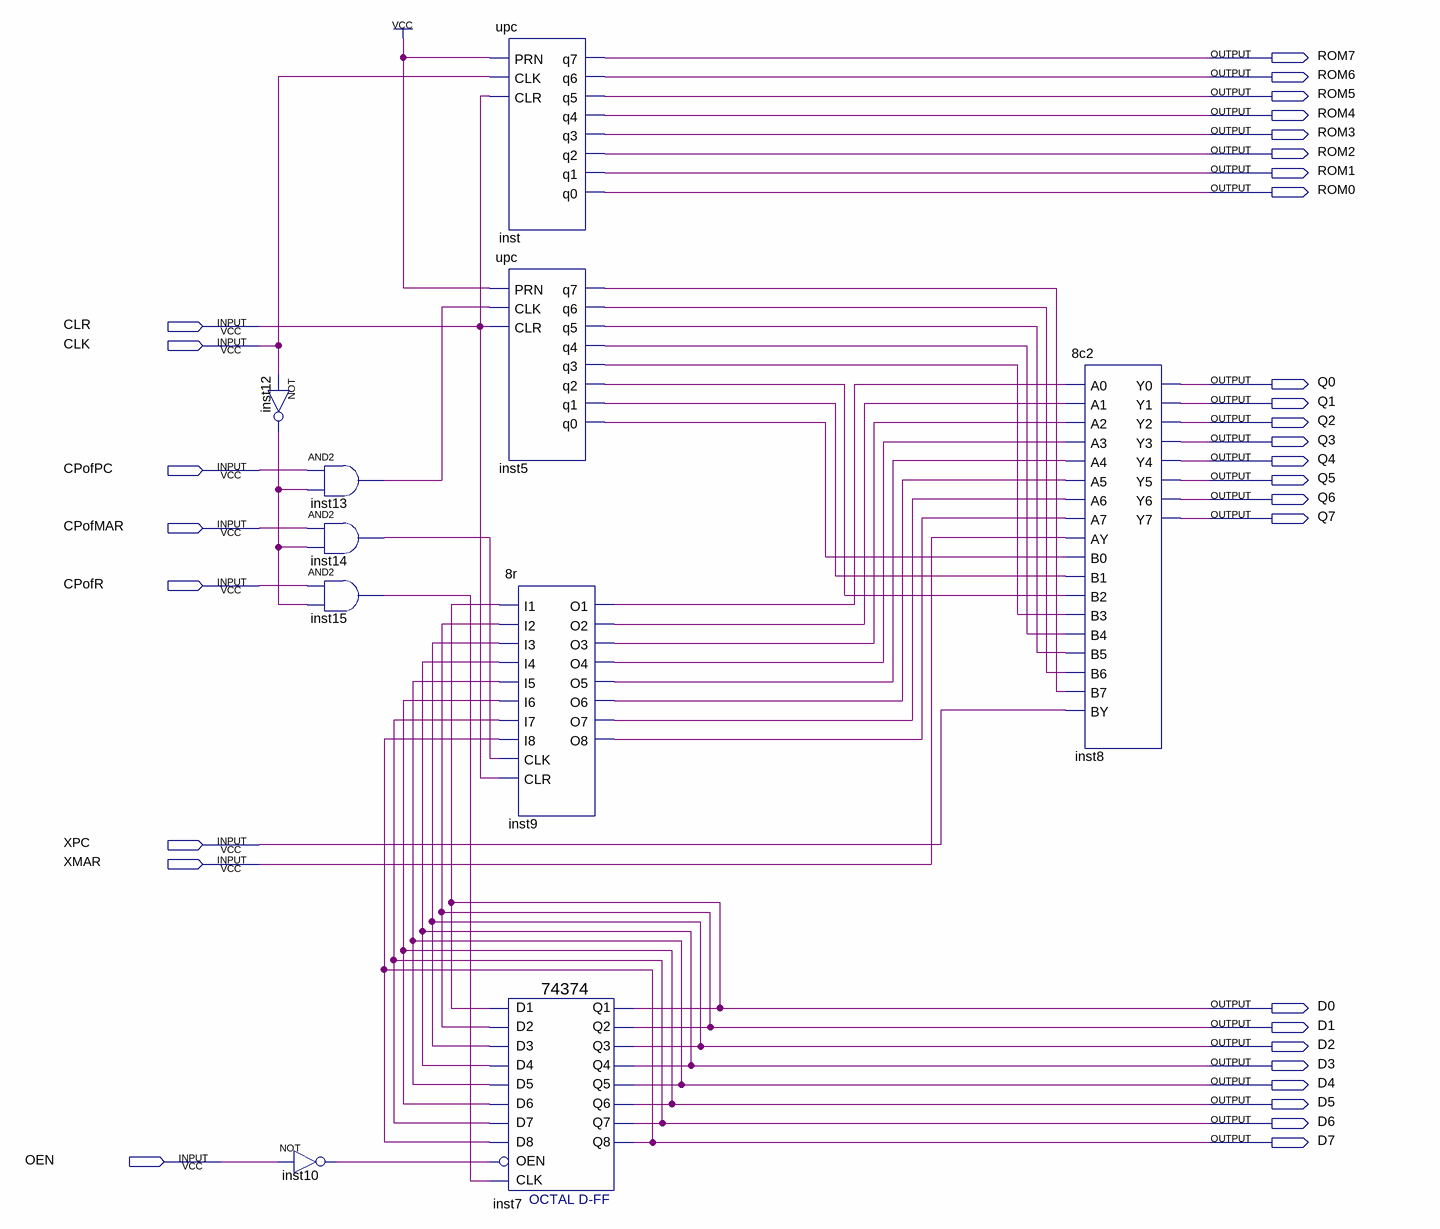
[diagram p0: schematic sheet]
// Quartus schematic final4.bdf as structural Verilog: 10 symbols, 32 pins
module final4 (
  input  CLR,
  input  CLK,
  input  CPofPC,
  input  CPofMAR,
  input  CPofR,
  input  XPC,
  input  XMAR,
  input  OEN,
  output ROM7,
  output ROM6,
  output ROM5,
  output ROM4,
  output ROM3,
  output ROM2,
  output ROM1,
  output ROM0,
  output Q0,
  output Q1,
  output Q2,
  output Q3,
  output Q4,
  output Q5,
  output Q6,
  output Q7,
  output D0,
  output D1,
  output D2,
  output D3,
  output D4,
  output D5,
  output D6,
  output D7
);

  wire inst5_q0, inst5_q1, inst5_q2, inst5_q3, inst5_q4, inst5_q5, inst5_q6, inst5_q7, inst9_o1, inst9_o2,
       inst9_o3, inst9_o4, inst9_o5, inst9_o6, inst9_o7, inst9_o8, inst10_out, inst12_out, inst13_out,
       inst14_out, inst15_out;

  not inst12 (inst12_out, CLK);
  not inst10 (inst10_out, OEN);
  and inst13 (inst13_out, CPofPC, inst12_out);
  and inst14 (inst14_out, CPofMAR, inst12_out);
  and inst15 (inst15_out, CPofR, inst12_out);
  upc inst (
    .PRN(1'b1), .CLK(CLK), .CLR(CLR), .q7(ROM7), .q6(ROM6), .q5(ROM5), .q4(ROM4), .q3(ROM3), .q2(ROM2),
    .q1(ROM1), .q0(ROM0));
  upc inst5 (
    .PRN(1'b1), .CLK(inst13_out), .CLR(CLR), .q7(inst5_q7), .q6(inst5_q6), .q5(inst5_q5), .q4(inst5_q4),
    .q3(inst5_q3), .q2(inst5_q2), .q1(inst5_q1), .q0(inst5_q0));
  \8r  inst9 (
    .I1(D0), .I2(D1), .I3(D2), .I4(D3), .I5(D4), .I6(D5), .I7(D6), .I8(D7), .CLK(inst14_out), .CLR(CLR),
    .O1(inst9_o1), .O2(inst9_o2), .O3(inst9_o3), .O4(inst9_o4), .O5(inst9_o5), .O6(inst9_o6), .O7(inst9_o7),
    .O8(inst9_o8));
  \74374  inst7 (
    .D1(D0), .D2(D1), .D3(D2), .D4(D3), .D6(D5), .D5(D4), .OEN(inst10_out), .D8(D7), .D7(D6),
    .CLK(inst15_out), .Q2(D1), .Q3(D2), .Q5(D4), .Q4(D3), .Q6(D5), .Q7(D6), .Q8(D7), .Q1(D0));
  \8c2  inst8 (
    .A0(inst9_o1), .A1(inst9_o2), .A2(inst9_o3), .A3(inst9_o4), .A4(inst9_o5), .A5(inst9_o6), .A6(inst9_o7),
    .A7(inst9_o8), .AY(XMAR), .B0(inst5_q0), .B1(inst5_q1), .B2(inst5_q2), .B3(inst5_q3), .B4(inst5_q4),
    .B5(inst5_q5), .B6(inst5_q6), .B7(inst5_q7), .BY(XPC), .Y0(Q0), .Y1(Q1), .Y2(Q2), .Y3(Q3), .Y4(Q4),
    .Y5(Q5), .Y6(Q6), .Y7(Q7));
endmodule
